# EAGLE design mindspy (EAGLE 6.4)
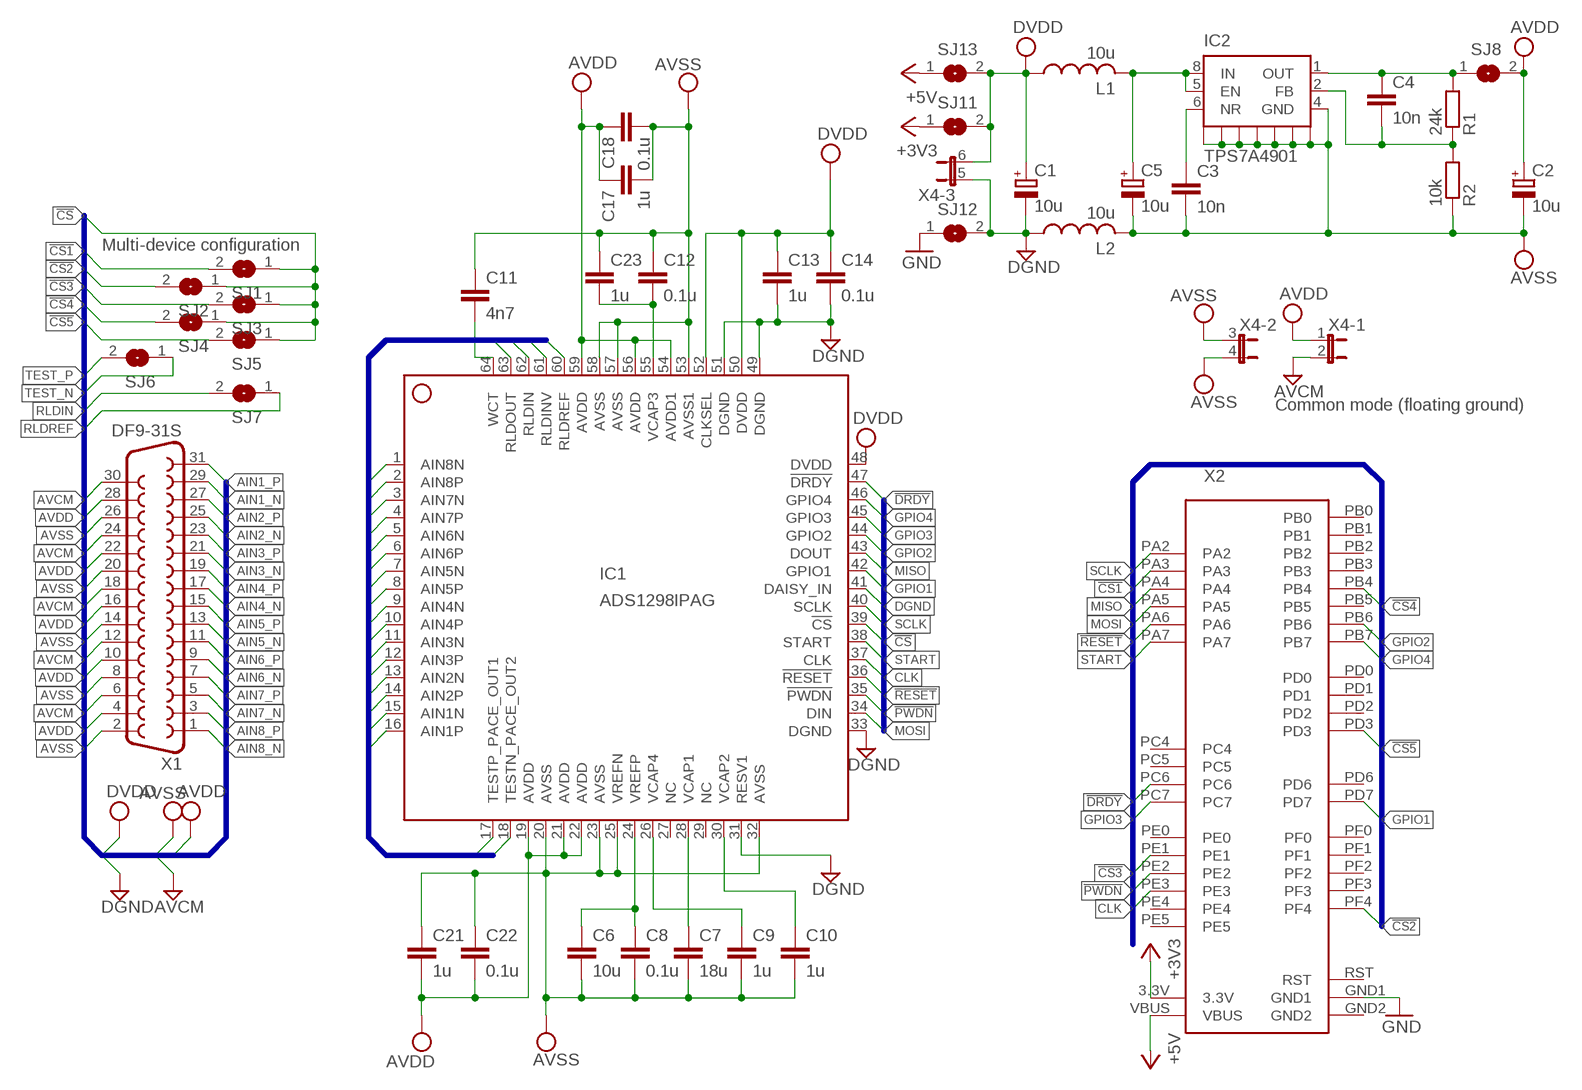
[diagram p0: schematic, sheet 1]

## Parts
C1  10u  CPOL-EUSMCA  [SMC_A]
C2  10u  CPOL-EUSMCA  [SMC_A]
C3  10n  C-EUC0603  [C0603]
C4  10n  C-EUC0603  [C0603]
C5  10u  CPOL-EUSMCA  [SMC_A]
C6  10u  C-EUC0805  [C0805]
C7  18u  C-EUC0805  [C0805]
C8  0.1u  C-EUC0402  [C0402]
C9  1u  C-EUC0402  [C0402]
C10  1u  C-EUC0402  [C0402]
C11  4n7  C-EUC0402  [C0402]
C12  0.1u  C-EUC0402  [C0402]
C13  1u  C-EUC0402  [C0402]
C14  0.1u  C-EUC0402  [C0402]
C17  1u  C-EUC0402  [C0402]
C18  0.1u  C-EUC0402  [C0402]
C21  1u  C-EUC0402  [C0402]
C22  0.1u  C-EUC0402  [C0402]
C23  1u  C-EUC0402  [C0402]
IC1  ADS1298IPAG  [LQFP64]
IC2  TPS7A4901  [MSOP08]
L1  10u  L1210  [L1210K]
L2  10u  L1210  [L1210K]
R1  24k  R-EU_R0402  [R0402]
R2  10k  R-EU_R0402  [R0402]
SJ1  SJ  [SJ]
SJ2  SJ  [SJ]
SJ3  SJ  [SJ]
SJ4  SJ  [SJ]
SJ5  SJ  [SJ]
SJ6  SJ  [SJ]
SJ7  SJ  [SJ]
SJ8  SJ  [SJ]
SJ11  SJ  [SJ]
SJ12  SJ  [SJ]
SJ13  SJ  [SJ]
X1  DF9-31S  [DF9-31S]
X2  STELLARIS-LAUNCHPAD-HALF  [LAUNCHPAD-L]
X4  JP3QE  [JP3Q]

## Nets
!CS: IC1.39(!CS) SJ1.1 SJ2.1 SJ3.1 SJ4.1 SJ5.1
!CS1: SJ1.2 X2.PA3
!CS2: SJ2.2 X2.PF4
!CS3: SJ3.2 X2.PE1
!CS4: SJ4.2 X2.PB4
!CS5: SJ5.2 X2.PD3
!DRDY: IC1.47(!DRDY) X2.PC6
!PWDN: IC1.35(!PWDN) X2.PE2
!RESET: IC1.36(!RESET) X2.PA6
+3V3: SJ11.1 X2.3.3V
+5V: SJ13.1 X2.VBUS
AIN1_N: IC1.15(AIN1N) X1.29
AIN1_P: IC1.16(AIN1P) X1.31
AIN2_N: IC1.13(AIN2N) X1.25
AIN2_P: IC1.14(AIN2P) X1.27
AIN3_N: IC1.11(AIN3N) X1.21
AIN3_P: IC1.12(AIN3P) X1.23
AIN4_N: IC1.9(AIN4N) X1.17
AIN4_P: IC1.10(AIN4P) X1.19
AIN5_N: IC1.7(AIN5N) X1.13
AIN5_P: IC1.8(AIN5P) X1.15
AIN6_N: IC1.5(AIN6N) X1.9
AIN6_P: IC1.6(AIN6P) X1.11
AIN7_N: IC1.3(AIN7N) X1.5
AIN7_P: IC1.4(AIN7P) X1.7
AIN8_N: IC1.1(AIN8N) X1.1
AIN8_P: IC1.2(AIN8P) X1.3
AVCM: X1.6 X1.12 X1.18 X1.24 X1.30 X4.2
AVDD: C2.+ C17.1 C18.1 C21.2 C22.2 IC1.19(AVDD) IC1.21(AVDD) IC1.22(AVDD) IC1.54(AVDD1) IC1.56(AVDD) IC1.59(AVDD) SJ8.2 X1.4 X1.10 X1.16 X1.22 X1.28 X4.1
AVDD2: C4.1 IC2.1(OUT) R1.2 SJ8.1
AVSS: C2.- C3.2 C5.- C6.2 C7.2 C8.2 C9.2 C10.2 C11.1 C12.1 C17.2 C18.2 C21.1 C22.1 C23.1 IC1.20(AVSS) IC1.23(AVSS) IC1.25(VREFN) IC1.32(AVSS) IC1.53(AVSS1) IC1.57(AVSS) IC1.58(AVSS) IC2.4(GND) IC2.NC@0(GND) IC2.NC@1(GND) IC2.NC@2(GND) IC2.NC@3(GND) IC2.NC@4(GND) IC2.PWR@1(GND) IC2.PWR@2(GND) L2.2 R2.1 X1.2 X1.8 X1.14 X1.20 X1.26 X4.3 X4.4
CLK: IC1.37(CLK) X2.PE3
DGND: C1.- C13.2 C14.2 IC1.31(RESV1) IC1.33(DGND) IC1.41(DAISY_IN) IC1.49(DGND) IC1.51(DGND) L2.1 SJ12.2 X4.5
DVDD: C1.+ C13.1 C14.1 IC1.48(DVDD) IC1.50(DVDD) IC1.52(CLKSEL) L1.1 SJ11.2 SJ13.2 X4.6
GND: SJ12.1 X2.GND1
GPIO1: IC1.42(GPIO1) X2.PD7
GPIO2: IC1.44(GPIO2) X2.PB6
GPIO3: IC1.45(GPIO3) X2.PC7
GPIO4: IC1.46(GPIO4) X2.PB7
MISO: IC1.43(DOUT) X2.PA4
MOSI: IC1.34(DIN) X2.PA5
N$1: C6.1 C8.1 IC1.24(VREFP)
N$2: C7.1 IC1.28(VCAP1)
N$3: C3.1 IC2.6(NR)
N$4: C9.1 IC1.26(VCAP4)
N$5: C10.1 IC1.30(VCAP2)
N$6: C12.2 C23.2 IC1.55(VCAP3)
N$7: C11.2 IC1.64(WCT)
N$19: C4.2 IC2.2(FB) R1.1 R2.2
N$22: C5.+ IC2.5(EN) IC2.8(IN) L1.2
RLDIN: IC1.62(RLDIN) SJ7.2
RLDINV: IC1.61(RLDINV)
RLDOUT: IC1.63(RLDOUT)
RLDREF: IC1.60(RLDREF) SJ7.1
SCLK: IC1.40(SCLK) X2.PA2
START: IC1.38(START) X2.PA7
TEST_N: IC1.18(TESTN_PACE_OUT2) SJ6.1
TEST_P: IC1.17(TESTP_PACE_OUT1) SJ6.2
Unconnected: IC1.27(NC) IC1.29(NC) X2.PB0 X2.PB1 X2.PB2 X2.PB3 X2.PB5 X2.PC4 X2.PC5 X2.PD0 X2.PD1 X2.PD2 X2.PD6 X2.PE0 X2.PE4 X2.PE5 X2.PF0 X2.PF1 X2.PF2 X2.PF3

## Buses
BUS

## Notes on the sheet
- Multi-device configuration
- Common mode (floating ground)

## Power pins joined to a net without a drawn wire
GND2: X2.GND2
RST: X2.RST

## Library data of the parts
C1 C2 C5 = rcl:CPOL-EU: POLARIZED CAPACITOR, European symbol
C3 C4 C6-C14 C17 C18 C21-C23 = rcl:C-EU: CAPACITOR, European symbol
IC1 = ti:ADS1298: Quad/Octal, Simultaneous Sampling, 24-Bit Analog-to-Digital Converters ADS1294 / ADS1298 Source: http://www.ti.com/lit/ds/symlink/ads1298.pdf
IC2 = ti:TPS7A49*: Ultralow-Noise, Positive LINEAR REGULATOR, +36V, +150mA WITH 8-PIN PSOP PACKAGING Source: http://www.ti.com/lit/ds/symlink/tps7a4901.pdf
L1 L2 = fabhack:L1210
R1 R2 = rcl:R-EU_: RESISTOR, European symbol
SJ1-SJ8 SJ11-SJ13 = jumper:SJ: SMD solder JUMPER
X1 = hirose:DF9-31S: SMD CONNECTOR Source: con-hirose.lbr from Bob Starr <rtzaudio@mindspring.com>; MPN: DF9-31S-1V(32); OC_FARNELL: 1798382; OC_NEWARK: 74R3383
X2 = ti:STELLARIS-LAUNCHPAD-*: Stellaris Launchpad LM4F120 using all header pins to connect to XL booster packs.
X4 = jumper:JP3QE: JUMPER

## Board
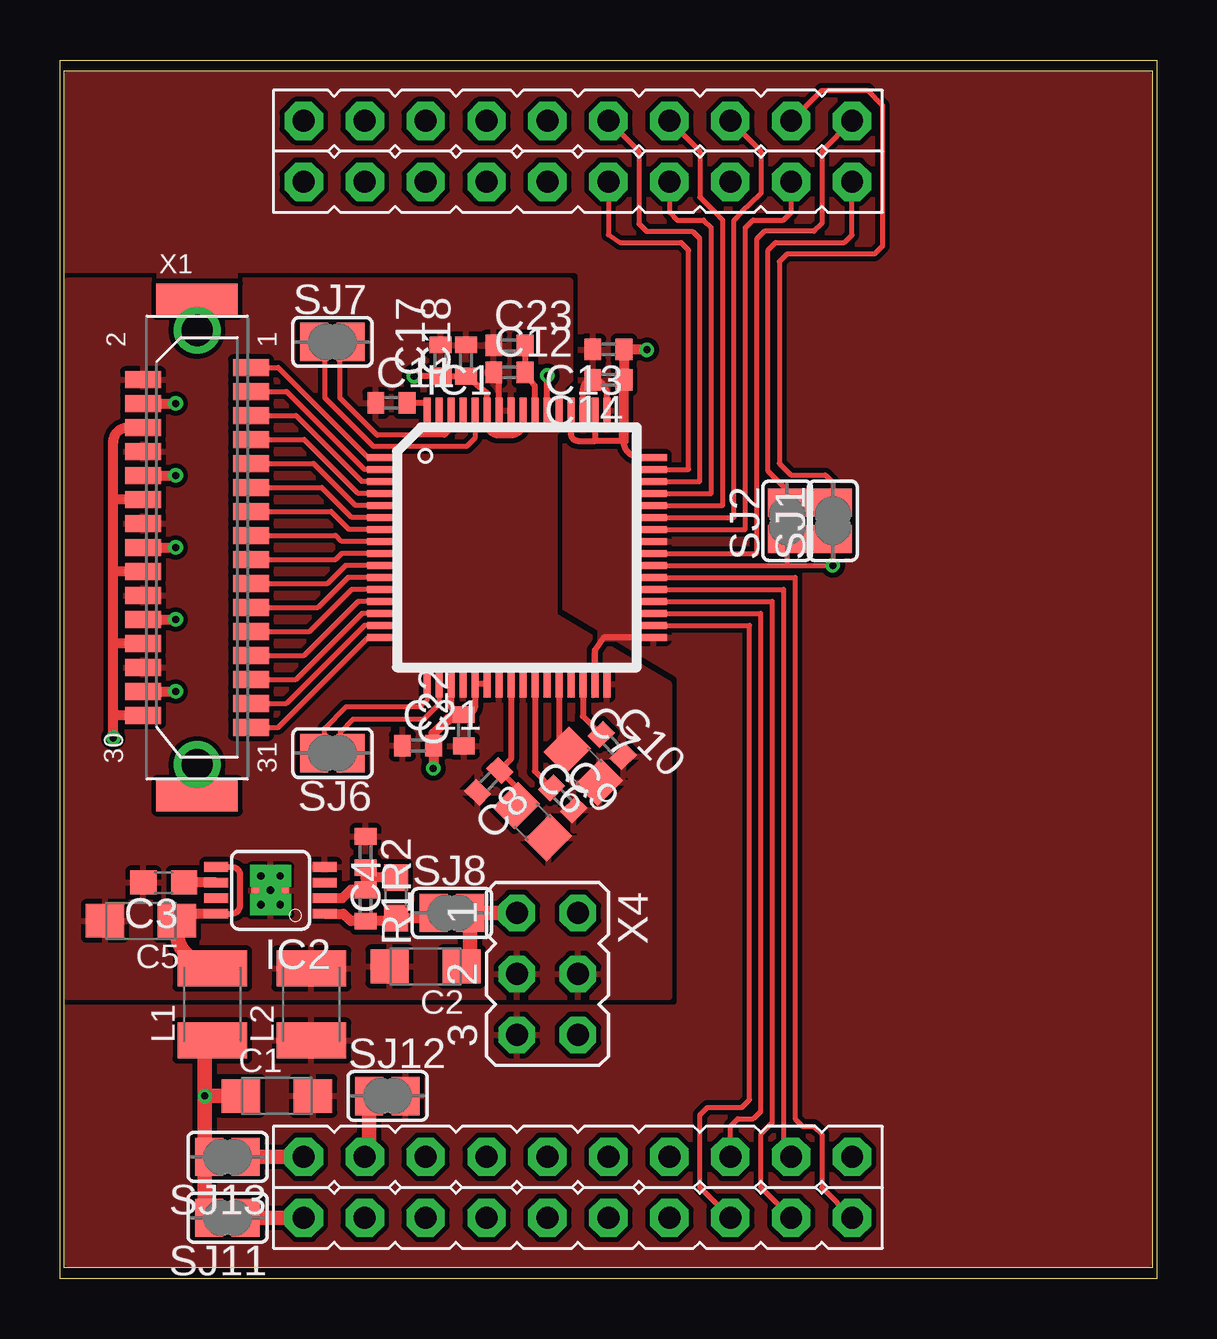
[diagram p1: board, top side]
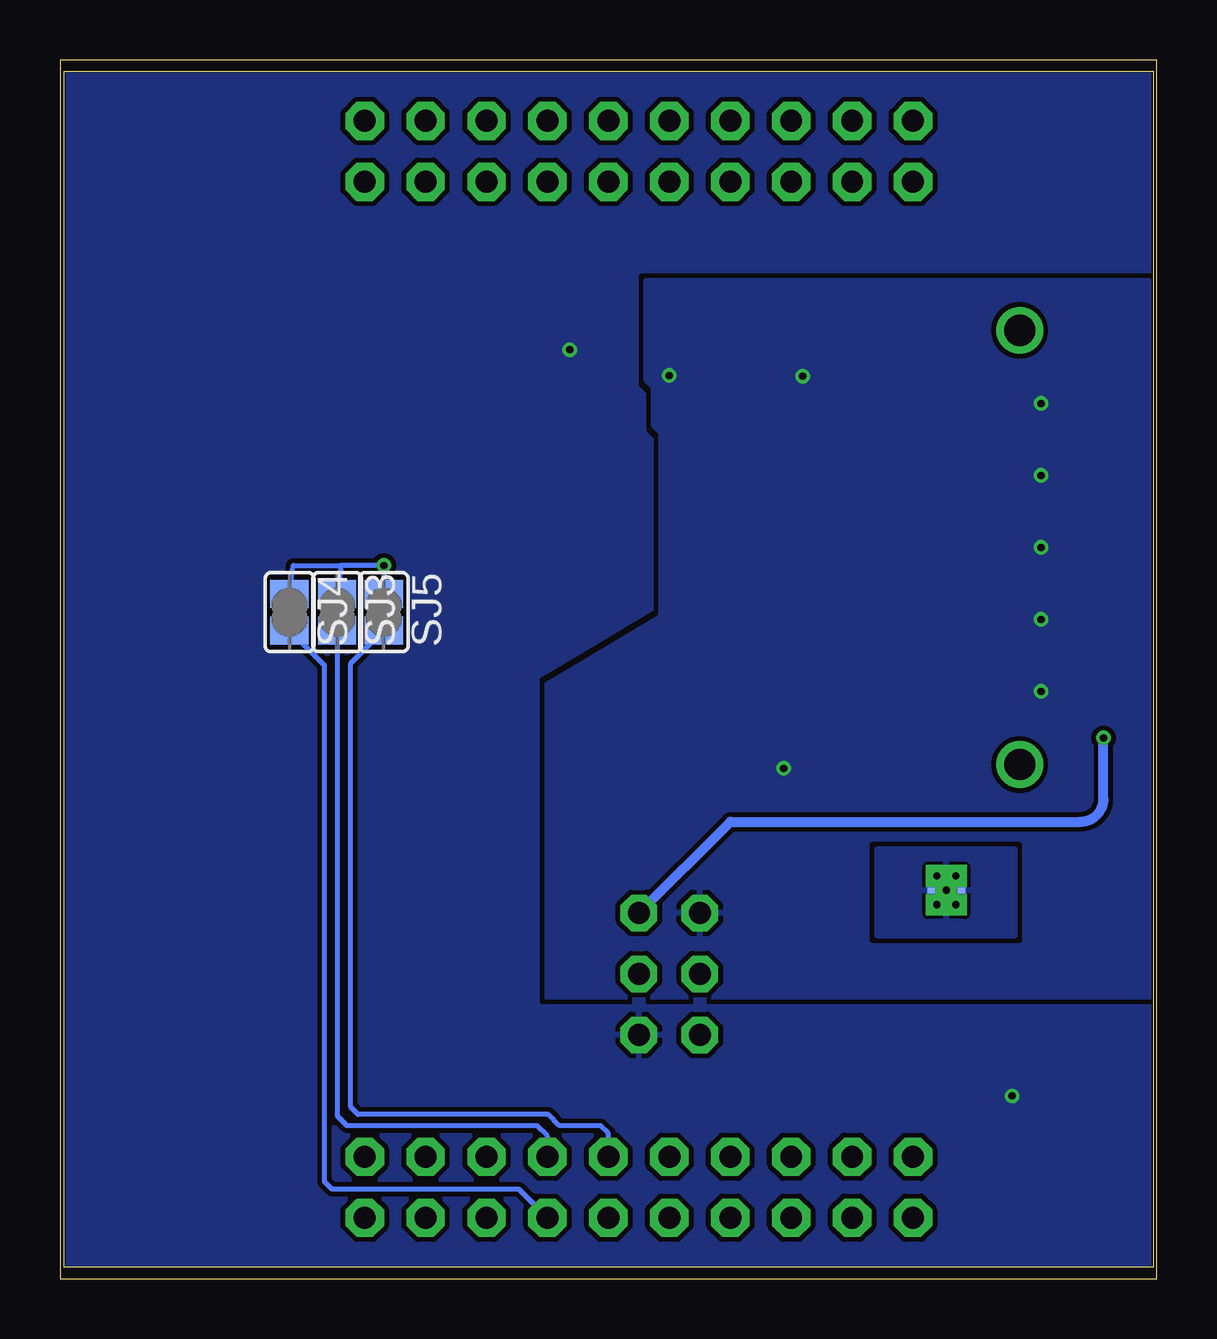
[diagram p2: board, bottom side, seen from below]

Size 45.72 x 50.8 mm. Coordinates in mm from the lower left corner, seen from the top.
Copper layers (1*16): Top 0.035mm / dielectric 1.5mm / Bottom 0.035mm
Design rules "prago *": minimum track width 6mil, minimum drill 0.3mm, track to track 8mil, track to pad 9mil, pad to pad 6mil, via to via 6mil, smd to smd 6mil, copper to edge 8mil, drill to drill 8mil, minimum pad ring 12mil, minimum via ring 6mil, stop-mask expansion 4mil, vias tented up to drill 15mil, thermal gap 8mil
Milling: 4 lines

### Footprints (pad centres in the part's own frame; a part is rotated, then mirrored left to right if it is on the bottom)
SMC_A = smd 1.6 x 1.4: + -1.5,0; - 1.5,0
C0603 = smd 1.1 x 1: 1 -0.85,0; 2 0.85,0
C0805 = smd 1.3 x 1.5: 1 -0.95,0; 2 0.95,0
C0402 = smd 0.7 x 0.9: 1 -0.65,0; 2 0.65,0
LQFP64 = smd 1.1 x 0.285: 1 -5.7,3.75; 2 -5.7,3.25; 3 -5.7,2.75; 4 -5.7,2.25; 5 -5.7,1.75; 6 -5.7,1.25; 7 -5.7,0.75; 8 -5.7,0.25; 9 -5.7,-0.25; 10 -5.7,-0.75; 11 -5.7,-1.25; 12 -5.7,-1.75; 13 -5.7,-2.25; 14 -5.7,-2.75; 15 -5.7,-3.25; 16 -5.7,-3.75; 33 5.7,-3.75; 34 5.7,-3.25; 35 5.7,-2.75; 36 5.7,-2.25; 37 5.7,-1.75; 38 5.7,-1.25; 39 5.7,-0.75; 40 5.7,-0.25; 41 5.7,0.25; 42 5.7,0.75; 43 5.7,1.25; 44 5.7,1.75; 45 5.7,2.25; 46 5.7,2.75; 47 5.7,3.25; 48 5.7,3.75 | smd 0.285 x 1.1: 17 -3.75,-5.7; 18 -3.25,-5.7; 19 -2.75,-5.7; 20 -2.25,-5.7; 21 -1.75,-5.7; 22 -1.25,-5.7; 23 -0.75,-5.7; 24 -0.25,-5.7; 25 0.25,-5.7; 26 0.75,-5.7; 27 1.25,-5.7; 28 1.75,-5.7; 29 2.25,-5.7; 30 2.75,-5.7; 31 3.25,-5.7; 32 3.75,-5.7; 49 3.75,5.7; 50 3.25,5.7; 51 2.75,5.7; 52 2.25,5.7; 53 1.75,5.7; 54 1.25,5.7; 55 0.75,5.7; 56 0.25,5.7; 57 -0.25,5.7; 58 -0.75,5.7; 59 -1.25,5.7; 60 -1.75,5.7; 61 -2.25,5.7; 62 -2.75,5.7; 63 -3.25,5.7; 64 -3.75,5.7
MSOP08 = smd 0.4 x 1: 1 -0.976,-2.263; 2 -0.326,-2.263; 3 0.324,-2.263; 4 0.974,-2.263; 5 0.974,2.262; 6 0.324,2.262; 7 -0.326,2.262; 8 -0.976,2.262 | drill 0.3 pad 0.61 square: NC@0 0,0; NC@1 -0.6,-0.4; NC@2 0.6,-0.4; NC@3 -0.6,0.4; NC@4 0.6,0.4 | smd 1.981 x 1.575 bottom: PWR@1 0,0 | smd 1.981 x 1.575: PWR@2 0,0
L1210K = smd 1.5 x 2.9: 1 -1.5,0; 2 1.5,0
R0402 = smd 0.7 x 0.9: 1 -0.65,0; 2 0.65,0
SJ = smd 1.168 x 1.6: 1 -0.762,0; 2 0.762,0
DF9-31S = smd 0.7 x 1.5: 1 -7.5,2.25; 2 -7,-2.25; 3 -6.5,2.25; 4 -6,-2.25; 5 -5.5,2.25; 6 -5,-2.25; 7 -4.5,2.25; 8 -4,-2.25; 9 -3.5,2.25; 10 -3,-2.25; 11 -2.5,2.25; 12 -2,-2.25; 13 -1.5,2.25; 14 -1,-2.25; 15 -0.5,2.25; 16 0,-2.25; 17 0.5,2.25; 18 1,-2.25; 19 1.5,2.25; 20 2,-2.25; 21 2.5,2.25; 22 3,-2.25; 23 3.5,2.25; 24 4,-2.25; 25 4.5,2.25; 26 5,-2.25; 27 5.5,2.25; 28 6,-2.25; 29 6.5,2.25; 30 7,-2.25; 31 7.5,2.25 | drill 1.3: D1 -9.05,0; D2 9.05,0 | smd 1.3 x 3.4: M1 -10.35,0; M2 10.35,0
LAUNCHPAD-L = drill 0.914 pad 1.6 octagon: 3.3V 10.16,2.54; GND1 12.7,5.08; GND2 10.16,48.26; PA2 33.02,48.26; PA3 30.48,48.26; PA4 27.94,48.26; PA5 27.94,2.54; PA6 30.48,2.54; PA7 33.02,2.54; PB0 15.24,2.54; PB1 17.78,2.54; PB2 12.7,48.26; PB3 15.24,45.72; PB4 25.4,2.54; PB5 12.7,2.54; PB6 25.4,48.26; PB7 22.86,48.26; PC4 17.78,45.72; PC5 20.32,45.72; PC6 22.86,45.72; PC7 25.4,45.72; PD0 15.24,5.08; PD1 17.78,5.08; PD2 20.32,5.08; PD3 22.86,5.08; PD6 27.94,45.72; PD7 30.48,45.72; PE0 15.24,48.26; PE1 25.4,5.08; PE2 27.94,5.08; PE3 30.48,5.08; PE4 20.32,2.54; PE5 22.86,2.54; PF0 17.78,48.26; PF1 33.02,5.08; PF2 10.16,45.72; PF3 12.7,45.72; PF4 33.02,45.72; RST 20.32,48.26; VBUS 10.16,5.08
JP3Q = drill 0.914 octagon: 1 -2.54,-1.27; 2 -2.54,1.27; 3 0,-1.27; 4 0,1.27; 5 2.54,-1.27; 6 2.54,1.27

### Placement (x,y rotation side)
C1  9.05,7.62 0 top
C2  15.24,13.02 180 top
C3  4.33,16.51 180 top
C4  14.01,15.88 90 top
C5  3.38,14.92 180 top
C6  19.68,19.05 315 top
C7  21.81,21.37 315 top
C8  17.87,20.73 225 top
C9  20.95,20 315 top
C10  23.02,22.23 315 top
C11  13.81,36.51 0 top
C12  18.73,37.78 0 top
C13  22.86,38.73 180 top
C14  22.86,37.46 180 top
C17  15.87,38.27 90 top
C18  16.93,38.27 90 top
C21  14.92,22.23 0 top
C22  16.83,22.86 90 top
C23  18.73,38.9 0 top
IC1  19.05,30.48 0 top
IC2  8.77,16.19 90 top
L1  6.35,11.43 90 top
L2  10.48,11.43 90 top
R1  12.74,15.56 270 top
R2  12.74,17.78 270 top
SJ1  32.22,31.59 90 top
SJ2  30.31,31.59 90 top
SJ3  34.17,27.78 270 bottom
SJ4  36.15,27.78 270 bottom
SJ5  32.22,27.78 270 bottom
SJ6  11.36,21.91 180 top
SJ7  11.36,39.05 0 top
SJ8  16.34,15.25 0 top
SJ11  6.98,2.54 180 top
SJ12  13.65,7.62 0 top
SJ13  6.98,5.08 180 top
X1  5.71,30.48 270 top
X2  0,0 0 top
X4  20.32,12.7 270 top

### Tracks (layer width: path | path; a pad name or v marks a point on that pad's centre or on a via)
!CS  (via drill 0.3)
  Top 0.2: IC1.39 30.31,29.73 | 30.31,29.73 v32.22,29.73 SJ1.1 | SJ2.1 30.31,29.73
  Bottom 0.2: v32.22,29.73 34.01,29.73 | 34.01,29.73 35.99,29.73 SJ4.1 | 34.01,29.73 SJ3.1 | v32.22,29.73 | v32.22,29.73 SJ5.1
!CS1
  Top 0.2: X2.PA3 31.75,49.53 33.65,49.53 34.29,48.89 34.29,43.05 33.95,42.71 30.31,42.71 29.99,42.4 29.99,33.98 30.47,33.5 31.9,33.5 32.22,33.18 SJ1.2
!CS2
  Top 0.2: X2.PF4 33.02,43.5 32.7,43.19 29.83,43.19 29.51,42.87 29.51,33.67 30.31,32.87 SJ2.2
!CS3
  Bottom 0.2: X2.PE1 25.4,5.95 25.83,6.38 33.76,6.38 34.17,6.78 SJ3.2
!CS4
  Bottom 0.2: X2.PB4 26.59,3.73 34.38,3.73 34.69,4.04 34.69,25.56 SJ4.2
!CS5
  Bottom 0.2: X2.PD3 22.86,6.06 23.18,6.38 24.89,6.38 25.36,6.85 33.29,6.85 33.6,7.16 33.6,25.64 SJ5.2
!DRDY
  Top 0.2: IC1.47 26.2,33.73 26.2,42.87 25.89,43.19 23.35,43.19 22.86,43.52 X2.PC6
!PWDN
  Top 0.2: X2.PE2 27.94,6.35 28.26,6.67 28.9,6.67 29.22,6.98 29.22,27.73 IC1.35
!RESET
  Top 0.2: X2.PA6 29.21,3.81 29.21,6.03 29.69,6.51 29.69,28.23 IC1.36
+3V3
  Top 0.61: X2.3.3V SJ11.1
+5V
  Top 0.61: SJ13.1 X2.VBUS
AIN1_N
  Top 0.2: IC1.15 12.69,27.23 9.44,23.98 X1.29
AIN1_P
  Top 0.2: IC1.16 12.85,26.73 9.1,22.98 X1.31
AIN2_N
  Top 0.2: IC1.13 12.43,28.23 10.18,25.98 X1.25
AIN2_P
  Top 0.2: IC1.14 12.58,27.73 9.83,24.98 X1.27
AIN3_N
  Top 0.2: IC1.11 12.01,29.23 10.76,27.98 X1.21
AIN3_P
  Top 0.2: IC1.12 12.16,28.73 10.41,26.98 X1.23
AIN4_N
  Top 0.2: IC1.9 11.75,30.23 11.49,29.97 11.48,29.98 X1.17
AIN4_P
  Top 0.2: IC1.10 11.9,29.73 11.15,28.98 X1.19
AIN5_N
  Top 0.2: IC1.7 12.06,31.23 11.31,31.98 X1.13
AIN5_P
  Top 0.2: IC1.8 11.75,30.73 11.49,30.99 11.48,30.98 X1.15
AIN6_N
  Top 0.2: IC1.5 12.32,32.23 10.57,33.98 X1.9
AIN6_P
  Top 0.2: IC1.6 12.17,31.73 10.92,32.98 X1.11
AIN7_N
  Top 0.2: IC1.3 12.58,33.23 9.83,35.98 X1.5
AIN7_P
  Top 0.2: IC1.4 12.43,32.73 10.18,34.98 X1.7
AIN8_N
  Top 0.2: IC1.1 12.85,34.23 9.1,37.98 X1.1
AIN8_P
  Top 0.2: IC1.2 12.69,33.73 9.44,36.98 X1.3
AVCM  (via drill 0.3)
  Top 0.406: v2.22,22.54 2.22,23.48 | 2.22,26.48 2.22,23.65 2.22,23.48 | 2.22,26.48 2.22,29.48 | 2.22,29.48 2.22,32.48 | 2.22,32.48 2.22,34.89 arc-90 2.8,35.47 X1.6 arc90 X1.6 | X1.12 2.22,32.48 | X1.18 2.22,29.48 | X1.24 2.22,26.48 | X1.30 2.22,23.48
  Bottom 0.406: X4.2 17.78,19.05 3.17,19.05 arc-90 2.22,20 v2.22,22.54
AVDD  (via drill 0.3)
  Top 0.254: IC1.59 17.8,36.49 | IC1.22 IC1.21 17.3,23.82 arc-90 C22.2 arc-90 16.3,23.89 IC1.19 | 20.32,36.2 IC1.54 20.3,37.78 arc-90 v20.32,37.65 | IC1.59 17.8,36.91 C18.1 C17.1 v14.76,37.62 arc90 v14.76,37.62 | IC1.59 17.8,35.72 arc90 18.2,35.16 18.82,35.16 arc90 19.3,35.64 IC1.56
  Top 0.406: 15.57,21.27 v15.56,21.27 15.57,21.29 C21.2 15.57,22.73 16.02,23.18 16.19,23.34 C22.2 | X1.22 v4.82,27.48 | X1.16 v4.82,30.48 | X1.4 v4.82,36.48 | X1.10 v4.82,33.48 | X1.28 v4.82,24.48
  Top 0.61: X4.1 SJ8.2 arc-90 SJ8.2 17.1,13.37 arc-90 C2.+
  pour Bottom (rank 2): 0.32,41.59 0.32,11.75 25.4,11.75 25.4,24.78 23.81,25.72 20.64,27.62 20.64,35.24 20.95,35.56 20.95,37.15 21.27,37.46 21.27,41.59
AVDD2
  Top 0.406: IC2.1 11.81,15.22 12.12,14.91 R1.2 14.01,14.91 C4.1 15.57,15.02 SJ8.1
AVSS
  Top 0.254: IC1.58 18.3,37.56 C12.1
  pour Top: 0.32,41.59 0.32,11.75 25.4,11.75 25.4,24.78 23.81,25.72 20.64,27.62 20.64,35.24 20.95,35.56 20.95,37.15 21.27,37.46 21.27,41.59
  pour Bottom: 5.91,17.89 11.67,17.89 11.67,14.31 5.91,14.31
CLK
  Top 0.2: IC1.37 30.16,28.73 30.16,5.4 X2.PE3
DGND
  Top 0.254: IC1.51 21.8,37.05 arc-90 C14.2 arc-90 22.8,36.87 IC1.49 | IC1.31 22.3,26.19 22.68,26.73 IC1.33
  pour Top (rank 2): 0.32,50.17 0.32,0.63 45.4,0.63 45.4,50.17
DVDD  (via drill 0.3)
  Top 0.254: IC1.50 22.3,34.92 | 22.3,34.92 23.49,34.92 arc90 24.19,34.23 IC1.48 | IC1.52 21.3,35.21 arc90 21.59,34.92 22.3,34.92
  Top 0.406: C13.1 23.51,38.72 | 23.51,38.72 C14.1 23.51,36.97 23.49,36.97 23.49,34.92 | v24.47,38.72 23.51,38.72
  Top 0.61: v6.03,7.62 C1.+ | 6.03,5.08 6.03,2.73 SJ11.2 | 6.03,5.08 v6.03,7.62 | SJ13.2 6.03,5.08 | v6.03,7.62 6.03,9.61 L1.1
  pour Bottom (rank 3): 0.32,50.17 0.32,0.63 45.4,0.63 45.4,50.17
GND
  Top 0.61: SJ12.1 12.89,5.27 X2.GND1
GPIO1
  Top 0.2: IC1.42 28.57,31.23 28.57,43.81 28.89,44.13 30.16,44.13 30.48,44.45 X2.PD7
GPIO2
  Top 0.2: IC1.44 27.62,32.23 27.62,44.13 27.3,44.45 26.67,45.07 26.67,46.99 X2.PB6
GPIO3
  Top 0.2: IC1.45 27.15,32.73 27.15,43.81 26.83,44.13 25.72,44.13 25.4,44.45 X2.PC7
GPIO4
  Top 0.2: IC1.46 26.68,33.23 26.68,43.34 26.36,43.66 24.45,43.66 24.13,43.98 24.13,46.99 X2.PB7
MISO
  Top 0.2: IC1.43 28.1,31.73 28.1,44.13 28.41,44.45 29.21,45.23 29.21,46.99 X2.PA4
MOSI
  Top 0.2: X2.PA5 26.67,3.81 26.67,6.82 26.99,7.14 28.43,7.14 28.74,7.46 28.74,27.23 IC1.34
N$1
  Top 0.254: C6.1 19.01,20.51 C8.1 18.8,21.66 IC1.24
N$2
  Top 0.254: IC1.28 20.8,22.38 C7.1
N$3
  Top 0.406: IC2.6 C3.1
N$4
  Top 0.254: IC1.26 19.8,21.16 C9.1
N$5
  Top 0.254: IC1.30 21.8,23.45 C10.1
N$6
  Top 0.254: C23.2 C12.2 19.8,37.21 IC1.55
N$7
  Top 0.254: IC1.64 15.28,36.51 C11.2
N$19
  Top 0.406: IC2.2 11.78,15.87 12.12,16.21 R1.1 12.74,16.72 | 12.74,16.72 R2.2 | C4.2 12.74,16.72
N$22
  Top 0.254: IC2.5 7.16,17.17 arc-90 7.5,16.83 7.5,15.56 arc-90 7.16,15.22 IC2.8
  Top 0.406: IC2.8 5.17,15.22 C5.+
  Top 0.61: L1.2 6.07,12.93 6.07,13.22 arc-90 4.87,14.42 C5.+
RLDIN
  Top 0.2: IC1.62 16.3,35.44 16.02,35.16 13.22,35.16 11.67,36.72 11.67,38.29 SJ7.2
RLDREF
  Top 0.2: IC1.60 17.3,35.04 16.96,34.69 13.07,34.69 11.05,36.72 11.05,38.29 SJ7.1
SCLK
  Top 0.2: X2.PA2 31.75,46.99 31.75,43.98 31.43,43.66 29.36,43.66 29.04,43.34 29.04,30.23 IC1.40
START
  Top 0.2: IC1.38 30.64,29.23 30.64,6.67 30.95,6.35 31.43,6.35 31.75,6.03 31.75,3.81 X2.PA7
TEST_N
  Top 0.2: IC1.18 15.8,23.95 15.16,23.32 12.21,23.32 11.69,22.8 11.69,22.65 SJ6.1
TEST_P
  Top 0.2: IC1.17 15.3,24.11 15.02,23.82 11.91,23.82 11.02,22.94 11.02,22.65 SJ6.2

### Text on the board
Document: RLDREF/IN | 1u | u1 | 1u | 1u | u1 | 4n7 | u1 | AIN8 | ver. 0.2 | AIN1 | 1u | u1 | 1u | u1 | TESTP/N | 18u | 10k | 1u | 10n | 10u | 10n | 24k | MindSpy | - | 10u | + | 10u | 100uH | 100uH | - | + | + | - | 0V | 10u | 5V | 3V3